# EAGLE design nixi_board_zm_1080 (EAGLE 9.6.2)
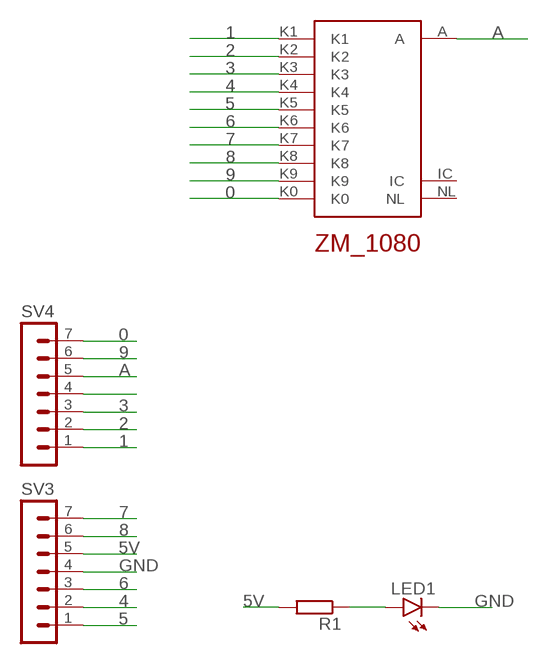
[diagram p0: schematic, sheet 1]

## Parts
LED1  LEDSMT1206  [1206]
R1  R-EU_R1206  [R1206]
SV3  MA07-1  [MA07-1]
SV4  MA07-1  [MA07-1]
U$2  ZM_1080  [ZM_1080]

## Nets
0: SV4.7 U$2.K0
1: SV4.1 U$2.K1
2: SV4.2 U$2.K2
3: SV4.3 U$2.K3
4: SV3.2 U$2.K4
5: SV3.1 U$2.K5
5V: R1.2 SV3.5
6: SV3.3 U$2.K6
7: SV3.7 U$2.K7
8: SV3.6 U$2.K8
9: SV4.6 U$2.K9
A: SV4.5 U$2.A
GND: LED1.C SV3.4
N$1: LED1.A R1.1
N$13: SV4.4
Unconnected: U$2.IC U$2.NL

## Library data of the parts
LED1 = led:LED: LED OSRAM: - CHIPLED LG R971, LG N971, LY N971, LG Q971, LY Q971, LO R971, LY R971 LH N974, LH R974 LS Q976, LO Q976, LY Q976 LO Q996 - Hyper CHIPLED LW Q18S LB Q993, LB Q99A, LB R99A - SideLED LS A670, LO A670, LY A670, LG A670, LP A670 LB A673, LV A673, LT A673, LW A673 LH A674 LY A675 LS A676, LA A676, LO A676, LY A676, LW A676 LS A679, LY A679, LG A679 - Hyper Micro SIDELED® LS Y876, LA Y876, LO Y876, LY Y876 LT Y87S - SmartLED LW L88C, LW L88S LB L89C, LB L89S, LG L890 LS L89K, LO L89K, LY L89K LS L896, LA L896, LO L896, LY L896 - TOPLED LS T670, LO T670, LY T670, LG T670, LP T670 LSG T670, LSP T670, LSY T670, LOP T670, LYG T670 LG T671, LOG T671, LSG T671 LB T673, LV T673, LT T673, LW T673 LH T674 LS T676, LA T676, LO T676, LY T676, LB T676, LH T676, LSB T676, LW T676 LB T67C, LV T67C, LT T67C, LS T67K, LO T67K, LY T67K, LW E67C LS E67B, LA E67B, LO E67B, LY E67B, LB E67C, LV E67C, LT E67C LW T67C LS T679, LY T679, LG T679 LS T770, LO T770, LY T770, LG T770, LP T770 LB T773, LV T773, LT T773, LW T773 LH T774 LS E675, LA E675, LY E675, LS T675 LS T776, LA T776, LO T776, LY T776, LB T776 LHGB T686 LT T68C, LB T68C - Hyper Mini TOPLED® LB M676 - Mini TOPLED Santana® LG M470 LS M47K, LO M47K, LY M47K Source: http://www.osram.convergy.de LUXEON: - LUMILED® LXK2-PW12-R00, LXK2-PW12-S00, LXK2-PW14-U00, LXK2-PW14-V00 LXK2-PM12-R00, LXK2-PM12-S00, LXK2-PM14-U00 LXK2-PE12-Q00, LXK2-PE12-R00, LXK2-PE12-S00, LXK2-PE14-T00, LXK2-PE14-U00 LXK2-PB12-K00, LXK2-PB12-L00, LXK2-PB12-M00, LXK2-PB14-N00, LXK2-PB14-P00, LXK2-PB14-Q00 LXK2-PR12-L00, LXK2-PR12-M00, LXK2-PR14-Q00, LXK2-PR14-R00 LXK2-PD12-Q00, LXK2-PD12-R00, LXK2-PD12-S00 LXK2-PH12-R00, LXK2-PH12-S00 LXK2-PL12-P00, LXK2-PL12-Q00, LXK2-PL12-R00 Source: www.luxeon.com KINGBRIGHT: KA-3528ASYC Source: www.kingbright.com
R1 = rcl:R-EU_: RESISTOR, European symbol; SPICEPREFIX: R
SV3 SV4 = con-lstb:MA07-1: PIN HEADER; OC_FARNELL: unknown; OC_NEWARK: unknown
U$2 = zm_1080:ZM_1080

## Board
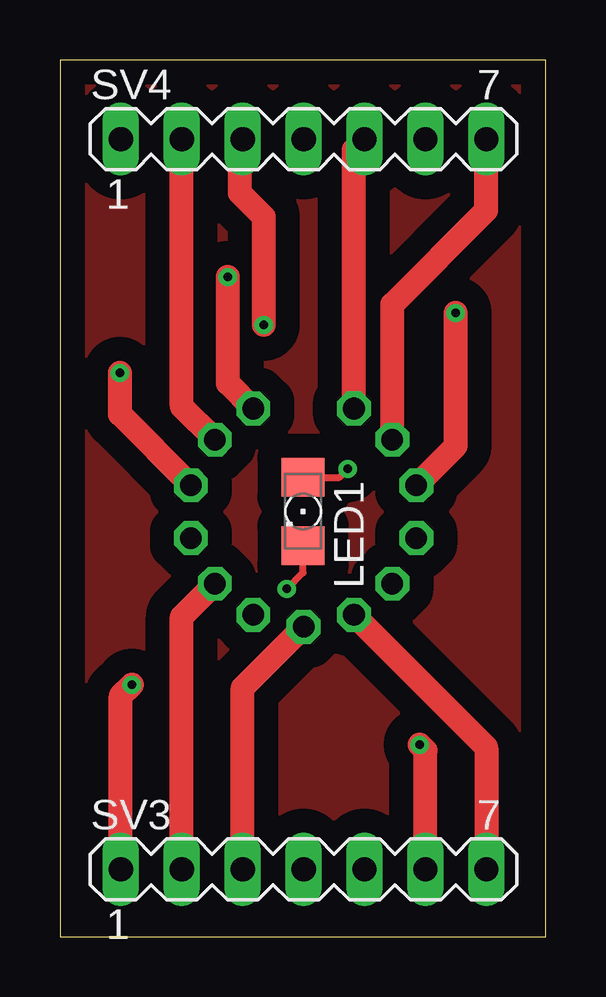
[diagram p1: board, top side]
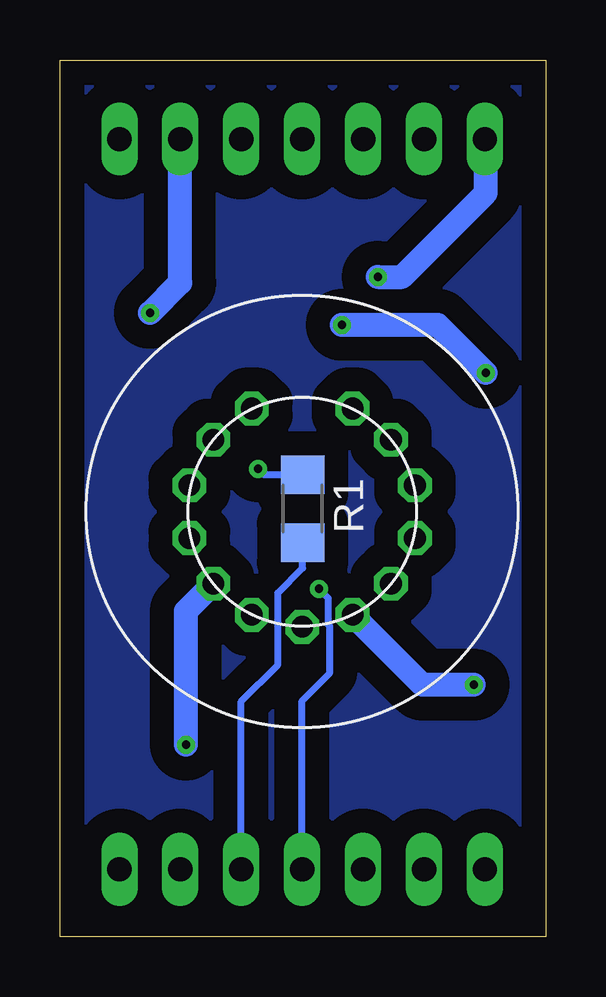
[diagram p2: board, bottom side, seen from below]

Size 20.26 x 36.55 mm. Coordinates in mm from the lower left corner, seen from the top.
Outline: 0,0 20.26,0 20.26,36.55 0,36.55 0,0
Copper layers (1*16): Top 0.035mm / dielectric 1.5mm / Bottom 0.035mm
Design rules "default": minimum track width 6mil, minimum drill 0.35mm, track to track 6mil, track to pad 6mil, pad to pad 6mil, via to via 6mil, smd to smd 6mil, copper to edge 40mil, drill to drill 6mil, minimum pad ring 10mil, minimum via ring 8mil, stop-mask expansion 4mil, vias tented up to drill 0mil, thermal gap 10mil

### Footprints (pad centres in the part's own frame; a part is rotated, then mirrored left to right if it is on the bottom)
1206 = smd 1.6 x 1.803: A -1.422,0; C 1.422,0
R1206 = smd 1.6 x 1.803: 1 -1.422,0; 2 1.422,0
MA07-1 = drill 1.016 long: 1 -7.62,0; 2 -5.08,0; 3 -2.54,0; 4 0,0; 5 2.54,0; 6 5.08,0; 7 7.62,0
ZM_1080 = drill 0.9 octagon: A 2.1,-4.3; IC -4.7,1.1; K0 3.7,-3; K1 -2.1,-4.3; K2 -3.7,-3; K3 -4.7,-1.1; K4 -3.7,3; K5 -2.1,4.3; K6 0,4.8; K7 2.1,4.3; K8 3.7,3; K9 4.7,-1.1; NL 4.7,1.1

### Placement (x,y rotation side)
LED1  10.14,17.73 270 top
R1  10.14,17.84 270 bottom
SV3  10.16,2.81 0 top
SV4  10.16,33.25 0 top
U$2  10.16,17.72 180 bottom

### Tracks (layer width: path | path; a pad name or v marks a point on that pad's centre or on a via)
0
  Top 1: U$2.K0 13.86,26.36 17.78,30.28 SV4.7
1  (via drill 0.35)
  Top 1: U$2.K1 7,23.08 v7,27.5
  Bottom 1: v7,27.5 6,27.5 2.5,31 2.5,33.21 SV4.1
2
  Top 1: U$2.K2 5.08,22.1 SV4.2
3  (via drill 0.35)
  Top 1: U$2.K3 2.5,21.78 v2.5,23.5 | SV4.3 7.5,33.13 7.5,31 8.5,30 v8.5,25.5
  Bottom 1: v2.5,23.5 4.5,25.5 v8.5,25.5
4
  Top 1: SV3.2 5.08,13.34 U$2.K4
5  (via drill 0.35)
  Top 1: SV3.1 2.54,10.04 v3,10.5
  Bottom 1: v3,10.5 5.14,10.5 U$2.K5
5V
  Bottom 0.3: SV3.5 12.7,9.8 11.17,11.33 11.17,14.34 10.14,15.36 R1.2
6
  Top 1: SV3.3 7.62,10.38 U$2.K6
7
  Top 1: U$2.K7 17.78,7.9 SV3.7
8  (via drill 0.35)
  Top 1: SV3.6 15.24,7.76 v15,8
  Bottom 1: v15,8 15,13.58 U$2.K8
9  (via drill 0.35)
  Top 1: U$2.K9 16.5,20.46 v16.5,26
  Bottom 1: v16.5,26 15.24,27.26 SV4.6
A
  Top 1: U$2.A 12.26,32.81 SV4.5
GND  (via drill 0.35)
  Top 0.3: v9.46,14.5 10.14,15.18 LED1.C
  Bottom 0.3: SV3.4 10.16,9.84 9,11 9,12.94 9.07,13 9.07,14.11 v9.46,14.5
N$1  (via drill 0.35)
  Top 0.3: LED1.A 11.65,19.15 v12,19.5
  Bottom 0.3: v12,19.5 11.76,19.26 R1.1
N$2
  pour Top (isolate 1): 0,36.5 0,0 20.5,0 20.5,36.5
N$3
  pour Bottom (isolate 1): 0,36.5 20.5,36.5 20.5,0 0,0